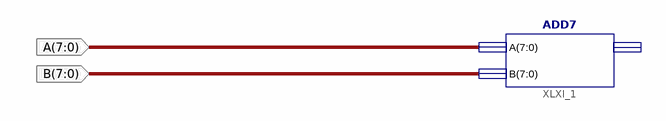
[diagram p0: schematic sheet 1]
// Xilinx ISE schematic ADD7Bit.sch (spartan6) as structural Verilog: 1 symbols, 2 ports
module ADD7Bit (
  input  [7:0] A,
  input  [7:0] B
);

  ADD7 XLXI_1 (.A(A), .B(B));  // open: O
endmodule
